# Altium project L-D5019-08.PrjPcb
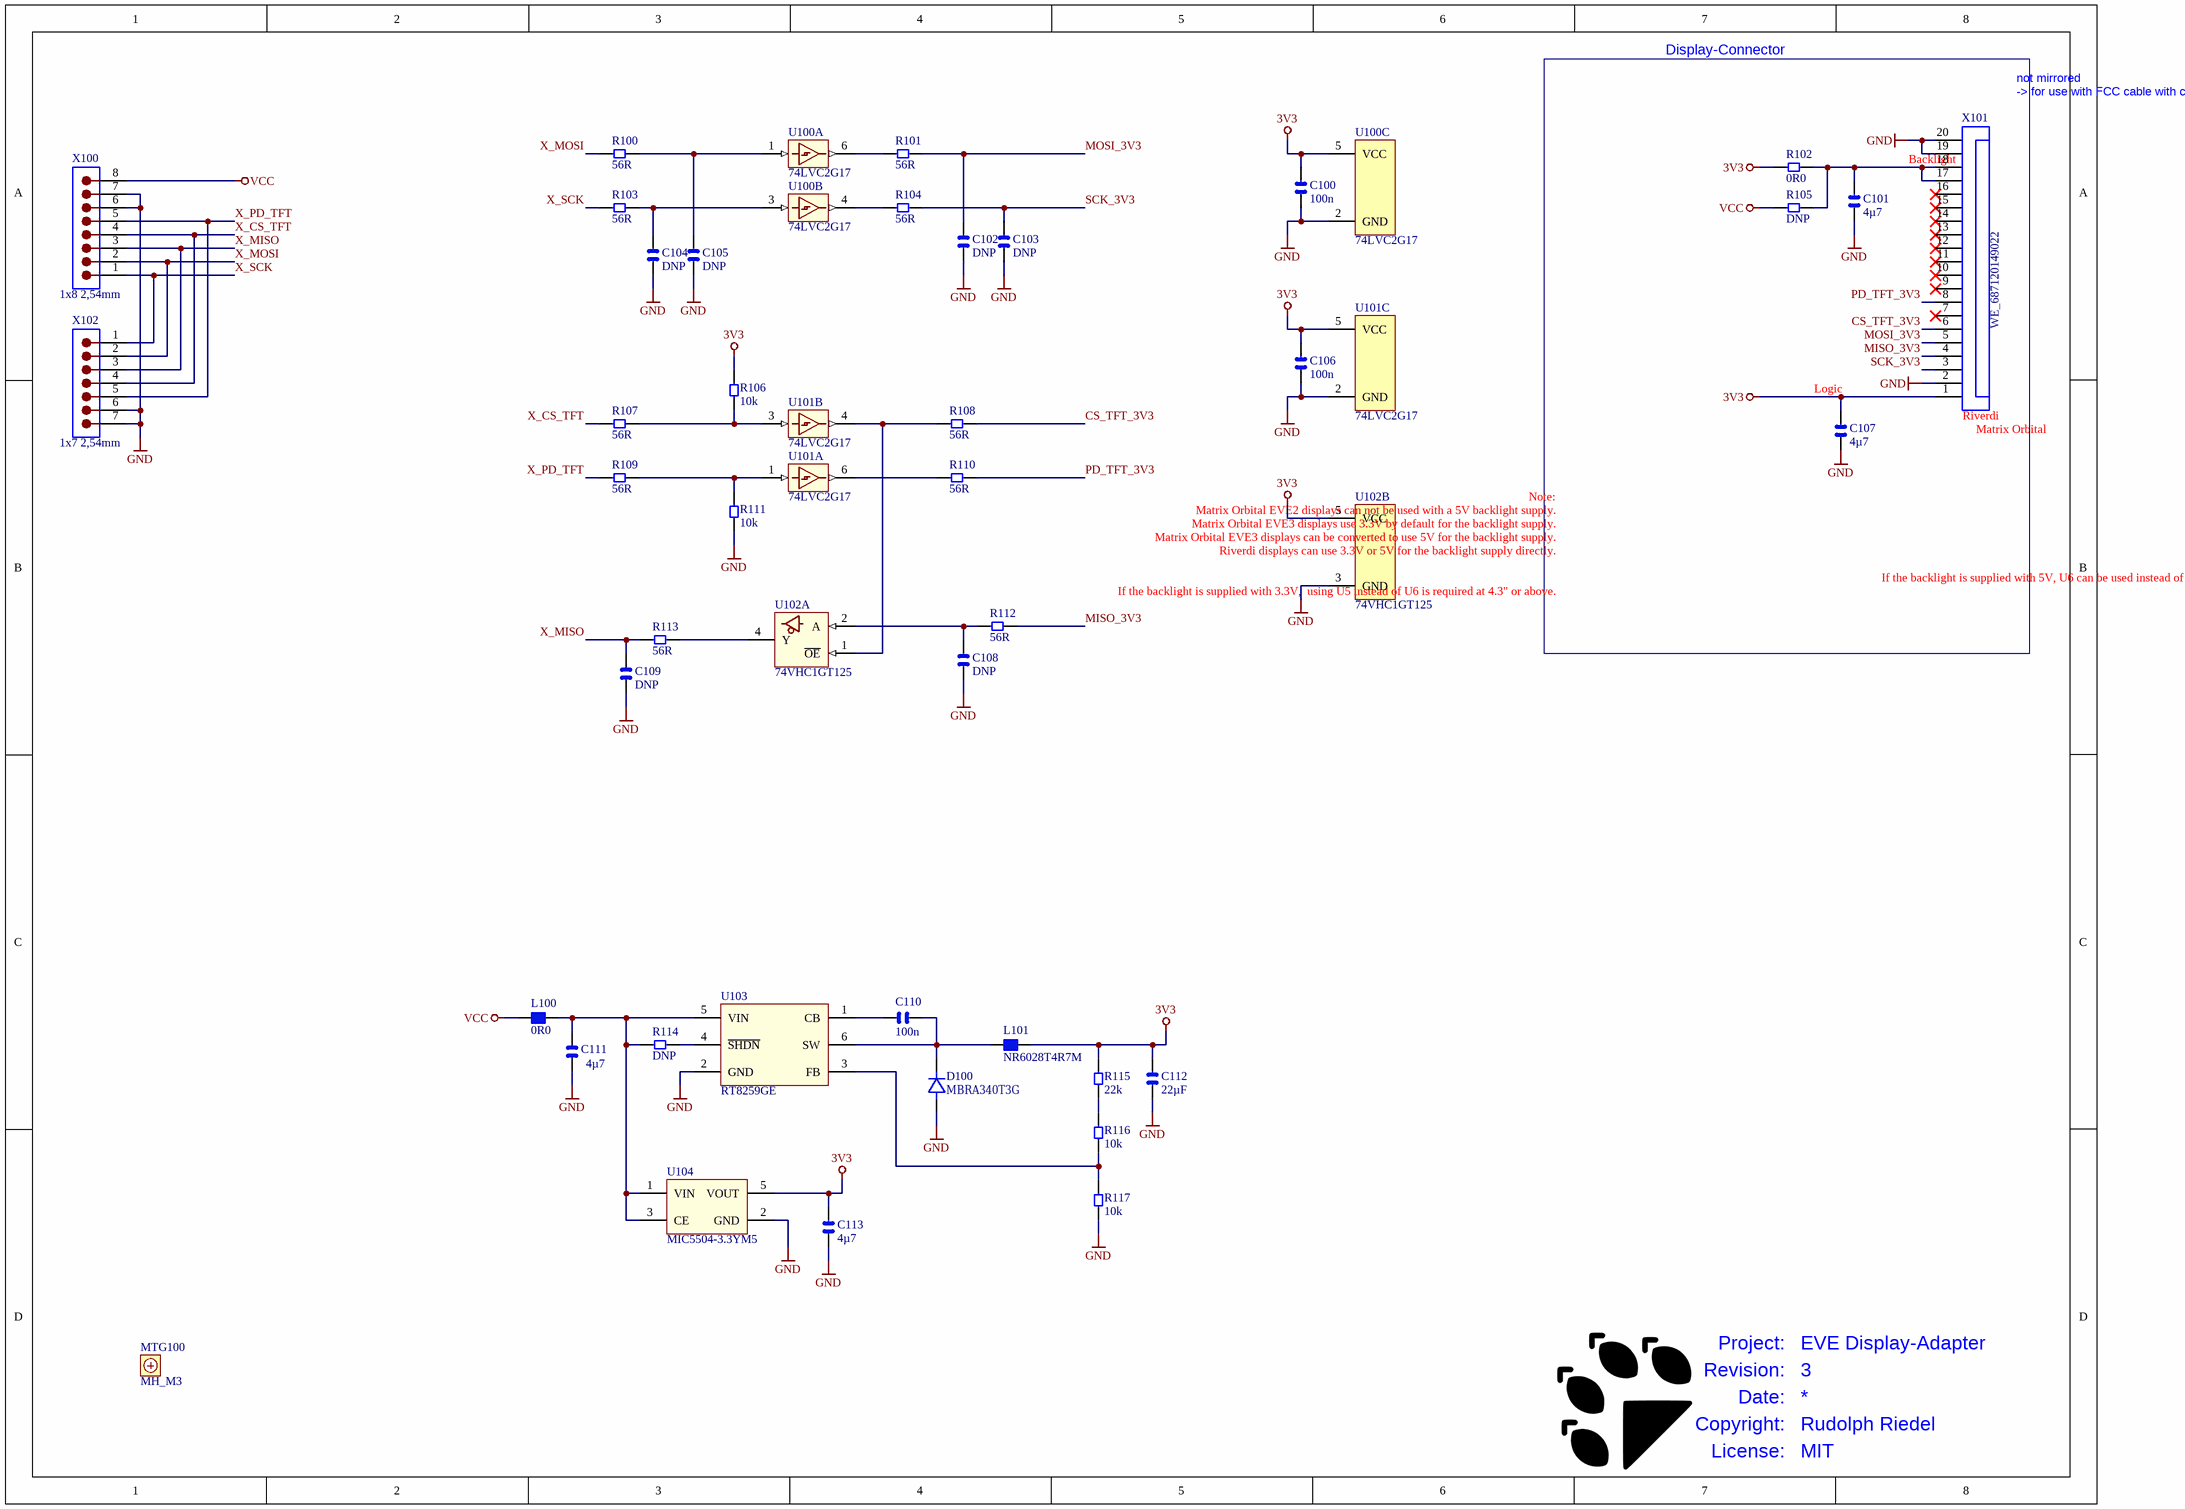
[diagram p0: L-D5019-08.SchDoc]
1 sheet, 44 parts. Net scope: global (net labels, ports and power ports of the same name join across sheets).
Board file: L-D5019-08.PcbDoc

## Sheet L-D5019-08.SchDoc: EVE Display-Adapter
size A3; Organization: Organization; Address1: Address1; Address2: Address2; Address3: Address3; Address4: Address4; DocumentNumber: 1; Revision: 3; SheetNumber: 1; SheetTotal: 1; PageSetup: Record=PageOptions|CenterHorizontal=True|CenterVertical=True|PrintScale=1.00|XCorrection=1.00|YCorrection=1.00|PrintKind=1|BorderSize=5000000|LeftOffset=0|BottomOffset=0|Orientation=2|PaperLength=1000|PaperWidth=1000|Scale=100|PaperSource=7|PrintQuality=-4|MediaType=1|DitherType=10|PaperKind=A3|PrintScaleMode=0

### Parts
C100  100n  [CAPC2012X14L]
C101  4µ7  [CAPC2012X14L]
C102  DNP  [CAPC2012X14L]
C103  DNP  [CAPC2012X14L]
C104  DNP  [CAPC2012X14L]
C105  DNP  [CAPC2012X14L]
C106  100n  [CAPC2012X14L]
C107  4µ7  [CAPC2012X14L]
C108  DNP  [CAPC2012X14L]
C109  DNP  [CAPC2012X14L]
C110  100n  [CAPC2012X14L]
C111  4µ7  [CAPC3216X19N]
C112  22µF  [CAPC3216X19N]
C113  4µ7  [CAPC2012X14L]
D100  MBRA340T3G‎  [DIOM5226X23N]
L100  0R0  [INDC2012X10L]
L101  NR6028T4R7M  [TaiyoYuden_NR6028]
MTG100  MH_M3  [HOLE_3_2MM]  (no BOM)
R100  56R  [RESC2012X06L]
R101  56R  [RESC2012X06L]
R102  0R0  [RESC2012X06L]
R103  56R  [RESC2012X06L]
R104  56R  [RESC2012X06L]
R105  DNP  [RESC2012X06L]
R106  10k  [RESC2012X06L]
R107  56R  [RESC2012X06L]
R108  56R  [RESC2012X06L]
R109  56R  [RESC2012X06L]
R110  56R  [RESC2012X06L]
R111  10k  [RESC2012X06L]
R112  56R  [RESC2012X06L]
R113  56R  [RESC2012X06L]
R114  DNP  [RESC2012X06L]
R115  22k  [RESC2012X06L]
R116  10k  [RESC2012X06L]
R117  10k  [RESC2012X06L]
U100  74LVC2G17  [SOT95P280X110-6N]  (parts A,B,C of 3)
U101  74LVC2G17  [SOT95P280X110-6N]  (parts A,B,C of 3)
U102  74VHC1GT125  [SOT95P280X110-5N]  (parts A,B of 2)
U103  RT8259GE  [SOT95P280X110-6N]
U104  MIC5504-3.3YM5  [SOT95P280X110-5N]
X100  1x8 2,54mm  [PINH_1x08_2_54mm]
X101  WE_687120149022  [WE_687120149022]
X102  1x7 2,54mm  [PINH_1x07_2_54mm]

### Blocks framed on the sheet
Display-Connector: C101 C107 R102 R105 X101

### Nets
3V3: C100.2 C106.2 C107.2 C112.2 C113.2 L101.2 R102.1 R106.2 R115.2 U100.5(VCC) U101.5(VCC) U102.5(VCC) U104.5(VOUT) X101.1
GND: C100.1 C101.1 C102.1 C103.1 C104.1 C105.1 C106.1 C107.1 C108.1 C109.1 C111.1 C112.1 C113.1 D100.2 R111.1 R117.1 U100.2(GND) U101.2(GND) U102.3(GND) U103.2(GND) U104.2(GND) X100.6 X100.7 X101.2 X101.19 X101.20 X102.6 X102.7
VCC: L100.1 R105.1 X100.8
CS_TFT_3V3: R108.2 X101.6
MISO_3V3: R112.2 X101.4
MOSI_3V3: C102.2 R101.2 X101.5
PD_TFT_3V3: R110.2 X101.8
SCK_3V3: C103.2 R104.2 X101.3
X_CS_TFT: R107.1 X100.4 X102.4
X_MISO: C109.2 R113.1 X100.3 X102.3
X_MOSI: R100.1 X100.2 X102.2
X_PD_TFT: R109.1 X100.5 X102.5
X_SCK: R103.1 X100.1 X102.1
NetC101_2: C101.2 R102.2 R105.2 X101.17 X101.18
NetC104_2: C104.2 R103.2 U100.3(2A)
NetC105_2: C105.2 R100.2 U100.1(1A)
NetC108_2: C108.2 R112.1 U102.2(A)
NetC110_1: C110.1 U103.1(CB)
NetC110_2: C110.2 D100.1 L101.1 U103.6(SW)
NetC111_2: C111.2 L100.2 R114.1 U103.5(VIN) U104.1(VIN) U104.3(CE)
NetR101_1: R101.1 U100.6(1Y)
NetR104_1: R104.1 U100.4(2Y)
NetR106_1: R106.1 R107.2 U101.3(2A)
NetR108_1: R108.1 U101.4(2Y) U102.1(~{OE})
NetR109_2: R109.2 R111.2 U101.1(1A)
NetR110_1: R110.1 U101.6(1Y)
NetR113_2: R113.2 U102.4(Y)
NetR114_2: R114.2 U103.4(~{SHDN})
NetR115_1: R115.1 R116.2
NetR116_1: R116.1 R117.2 U103.3(FB)

Not connected (* = marked no-connect by the designer): X101 7* 9* 10* 11* 12* 13* 14* 15* 16*

### Notes on the sheet
- (near X101) -> for use with FCC cable with connections on opposite sides
- not mirrored
- (near C101) Backlight
- (near C107) Logic
- (near X101) Riverdi
- (near X101) Matrix Orbital
- Matrix Orbital EVE2 displays can not be used with a 5V backlight supply.
- Note:
- Matrix Orbital EVE3 displays use 3.3V by default for the backlight supply.
- Riverdi displays can use 3.3V or 5V for the backlight supply directly.
- Matrix Orbital EVE3 displays can be converted to use 5V for the backlight supply.
- If the backlight is supplied with 5V, U6 can be used instead of U5.
- If the backlight is supplied with 3.3V,  using U5 instead of U6 is required at 4.3" or above.
- Project:
- Revision:
- Date:
- Copyright:
- License:
- Rudolph Riedel
- MIT

### Library data of the parts
C100 C102-C106 C108-C110 = CAPC_0805: 0805 Chip Capacitor; Editor: rriedel; Kategorie: generic; Unterart: unpolarized; Part Number: CAPC_0805; Status: tested; Bauteilart: Capacitor; PackageDescription: 0805
  C100 C106 C110: Value: 100n
  C102-C105 C108 C109: Value: DNP
C101 C107 C113 = CAPC_0805: 0805 Chip Capacitor; Ersteller: rriedel; Freigabe: unchecked; Bauteilart: Kondensator; Kategorie: generisch; Unterart: ungepolt; Polar: u; ID: 894; Part Number: CAPC_0805; Value: 4µ7; PackageDescription: 0805; Mounting: SMT; timestamp: 17.08.2016 13:43:45
C111 C112 = CAPC_1206: 1206 Chip Capacitor; Editor: rriedel; Kategorie: generic; Unterart: unpolarized; Part Number: CAPC_1206; Status: tested; Bauteilart: Capacitor; PackageDescription: 1206
  C111: Value: 4µ7
  C112: Value: 22µF
D100 = MBRA340T3G‎: Schottky Gleichrichterdiode, 40V / 3A / 450mV; Manufacturer: ON Semiconductor; Editor: rriedel; Kategorie: Part; Bauteilart: Diode; Unterart: Rectifier; Part Number: MBRA340T3G‎; Value: MBRA340T3G‎; Status: tested; Date: 19.09.2020; PackageDescription: SMA; Part_Number_1: MBRA340T3G‎; Distributor_1: Digi-Key; Distributor_1_Part_Number: MBRA340T3GOSCT-ND
L100 = INDC_0805: 0805 Chip Inductor; Editor: rriedel; Kategorie: generic; Part Number: INDC_0805; Value: 0R0; Status: tested; Date: 31.03.2019; Bauteilart: Inductor; Unterart: generic; PackageDescription: 0805
L101 = NR6028T4R7M: 4,7µH, shielded, 2,7A, 40mR; Manufacturer: Taiyo Yuden; Editor: rriedel; Kategorie: Part; Bauteilart: Inductor; Unterart: Power; Part Number: NR6028T4R7M; Value: NR6028T4R7M; Status: tested; Date: 19.09.2020; PackageDescription: 6x6 mm; Part_Number_1: NR6028T4R7M; Distributor_1: Digi-Key; Distributor_1_Part_Number: 587-2100-1-ND
MTG100 = MH_M3: Mounting-Hole for M3 screws; Editor: rriedel; Kategorie: No_Bom; Bauteilart: Mechanic; Unterart: Holes; Part Number: MH_M3; Value: MH_M3; Status: tested; Date: 13.05.2018
R100-R117 = RESC_0805: 0805 Chip Resistor; Editor: rriedel; Kategorie: generic; Part Number: RESC_0805; Status: tested; Bauteilart: Resistor; Unterart: generic; PackageDescription: 0805
  R100 R101 R103 R104 R107-R110 R112 R113: Value: 56R
  R102: Value: 0R0
  R105 R114: Value: DNP
  R106 R111 R116 R117: Value: 10k
  R115: Value: 22k
U100 U101 = 74LVC2G17: Dual Schmitt-Trigger Buffer with 5.5V tolerant inputs; Manufacturer: TI; Part_Number_1: 74LVC2G17DBVR; Editor: rriedel; Kategorie: Part; Bauteilart: IC; Unterart: Logic; Part Number: 74LVC2G17; Value: 74LVC2G17; Status: tested; Date: 08.05.2020; PackageDescription: SOT23-6; Distributor_1: Digi-Key; Distributor_1_Part_Number: 296-SN74LVC2G17DBVRCT-ND‎
U102 = 74VHC1GT125: 1x Buffer with OE; 3-state,Level Shifter 3,3V to 5V and 5V to 3.3V; Manufacturer: ON Semiconductor; Part_Number_1: M74VHC1G125DT1G; Editor: rriedel; Kategorie: Part; Bauteilart: IC; Unterart: Logic; Part Number: 74VHC1GT125; Value: 74VHC1GT125; Status: tested; Date: 21.01.2011; PackageDescription: SOT23-5; Distributor_1: Farnell; Distributor_1_Part_Number: 1703291
U103 = RT8259GE: Step-Down DC/DC Regulator, 24V, 1.2A, 1,4MHz; Manufacturer: Richtek; Editor: rriedel; Kategorie: Part; Bauteilart: IC; Unterart: Switching-Regulators; Part Number: RT8259GE; Value: RT8259GE; Status: tested; Date: 31.03.2019; PackageDescription: SOT23-6; Part_Number_1: RT8259GE; Distributor_1: Digi-Key; Distributor_1_Part_Number: 1028-1497-1-ND
U104 = MIC5504-3.3YM5: 300 mA LDO,  Vin=2,5V…5,5V, Vout= 3,3V, -40°C..125°C; Manufacturer: Microchip; Editor: rriedel; Kategorie: Part; Bauteilart: IC; Unterart: Linear-Regulators; Part Number: MIC5504-3.3YM5; Value: MIC5504-3.3YM5; Status: tested; Date: 23.05.2019; PackageDescription: SOT23-5; Part_Number_1: MIC5504-3.3YM5; Distributor_1: Farnell; Distributor_1_Part_Number: 2510377
X100 = PINH_1x8_2_54: Pin-Header 2,54 mm 8pins; Editor: rriedel; Kategorie: generic; Bauteilart: Connector; Part Number: PINH_1x8_2_54; Value: 1x8 2,54mm; Status: tested; Date: 07.02.2017; Unterart: Pin-Header
X101 = WE_687120149022: 20pin WR-FPC 0.50 mm SMT ZIF Horizontal - Bottom Contact; Manufacturer: Wuerth; Part_Number_1: 6.8712014902e+011; Editor: rriedel; Kategorie: Part; Bauteilart: Connector; Unterart: FPC; Part Number: WE_687120149022; Value: WE_687120149022; Status: tested; Date: 25.05.2020; PackageDescription: FPC 0.5mm; Distributor_1: Digi-Key; Distributor_1_Part_Number: 732-6002-1-ND
X102 = PINH_1x7_2_54: Pin-Header 2,54 mm 7pins; Editor: rriedel; Kategorie: generic; Bauteilart: Connector; Part Number: PINH_1x7_2_54; Value: 1x7 2,54mm; Status: tested; Date: 07.02.2017; Unterart: Pin-Header

## Assembly variants
Default: all parts fitted
EVE2/EVE3 default: not fitted C102 C103 C104 C105 C108 C109 C113 R105 R114 U104 X102